# Altium project C-to-MicroOTG.X1.PrjPcb
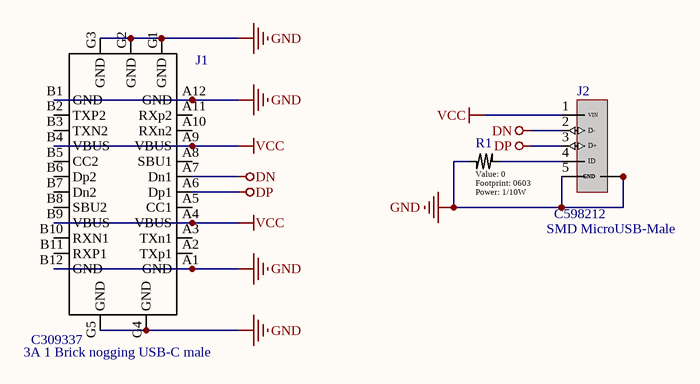
[diagram p0: CtoMicroOTG.SchDoc]
1 sheet, 3 parts. Net scope: global (net labels, ports and power ports of the same name join across sheets).
Board file: CtoMicroOTG.X1.PcbDoc

## Sheet CtoMicroOTG.SchDoc: Samsung Tablet Connector
size A; Date: 2/21/2023; Author: KEW; CompanyName: GAMBER-JOHNSON LLC; DrawnBy: KEW; Engineer: KEW; Revision: X1; SheetNumber: 1; SheetTotal: 1; RevisionEngineer: KEW; ProjectTitle: SK TA+Pro Dock/Charge; RevisionDate: 8/31/2023

### Parts
J1  3A 1 Brick nogging USB-C male  LCSC PN: C309337  [USB-309GD]
J2  SMD MicroUSB-Male  LCSC PN: C598212  [ZX80-B-5SA(30)]
R1  value 0  Power: 1/10W  [0603]  (hidden comment: Generic Resistor)

### Nets
DN: J1.A7(Dn1) J2.2(D-)
DP: J1.A6(Dp1) J2.3(D+)
GND: J1.A1(GND) J1.A12(GND) J1.B1(GND) J1.B12(GND) J1.G1(GND) J1.G2(GND) J1.G3(GND) J1.G4(GND) J1.G5(GND) J2.5(GND) J2.6(GND) J2.7(GND) J2.8(GND) J2.9(GND) R1.2
VCC: J1.A4(VBUS) J1.A9(VBUS) J1.B4(VBUS) J1.B9(VBUS) J2.1(VIN)
NetJ2_4: J2.4(ID) R1.1

Not connected (* = marked no-connect by the designer): J1 A2(TXp1) A3(TXn1) A5(CC1) A8(SBU1) A10(RXn2) A11(RXp2) B2(TXP2) B3(TXN2) B5(CC2) B6(Dp2) B7(Dn2) B8(SBU2) B10(RXN1) B11(RXP1)

### Notes on the sheet
- REV
- REVISIONS
- DATE
- DESCRIPTION
- BY
- UNLESS OTHERWISE SPECIFIED, DRAWING DEFINITIONS AND TOLERANCES SHALL BE FOUND UNDER SUPPLIER STANDARDS SS-001. THIS PART AND ALL COMPONENTS OF IT MUST BE RoHS & REACH COMPLIANT. A CERTIFICATE OF COMPLIANCE MUST BE PROVIDED UPON REQUEST.
- ALL INFORMATION ON THIS DOCUMENT IS THE SOLE PROPERTY OF GAMBER-JOHNSON AND SHALL NOT BE COPIED, REPRODUCED, USED OR DISCLOSED IN WHOLE OR IN PART WITHOUT THE WRITTEN CONSENT OF GAMBER-JOHNSON
- TOLERANCES
  .00 ± .060
  .000 ± .020
  .0000 ± .005
  ANGELS ± 1°
- DRAWN BY:
- PROJECT NUMBER:
- SHEET TITLE:
- SHEET
- OF
- DATE:
- LOCATION:
- ASSEMBLY NUMBER
- SIZE
- GAMBER-JOHNSON LLC
  5001 JOERNS DR.
  STEVENS POINT, WI 54481
  +1 (715) 344-5209
- B

### Library data of the parts
J1 = USB-309GD: 3A 1 Brick nogging 24P male -20℃~+60℃ Type-C SMD USB Connector
J2 = ZX80-B-5SA(30): USB 2.0 1 5P Male -30℃~+85℃ Micro-B SMD USB Connector
R1 = Generic Resistor: Tolerance: *